# Altium schematic sheet power.SchDoc
size A1
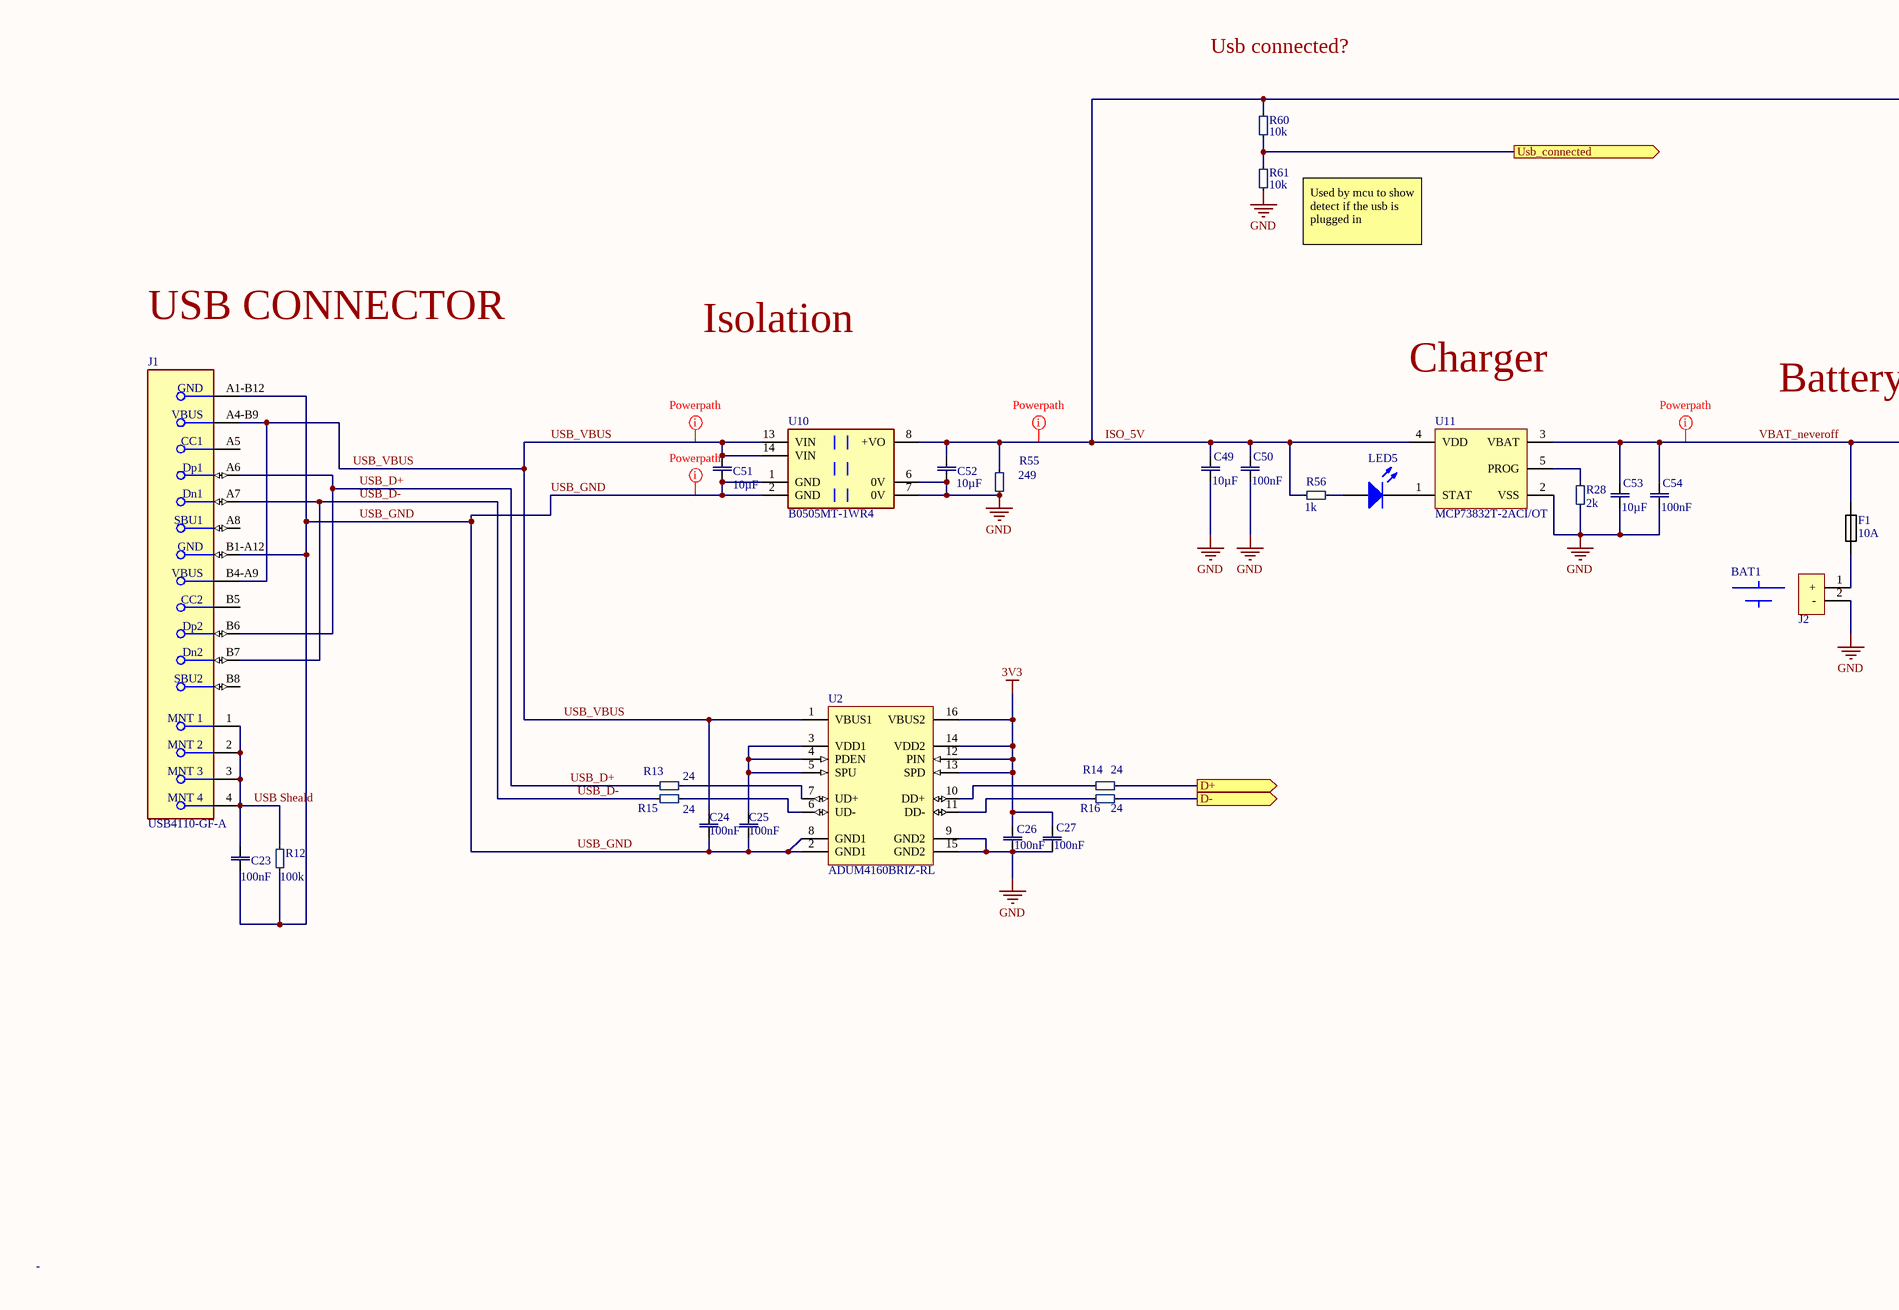
[diagram p0: power.SchDoc, left]
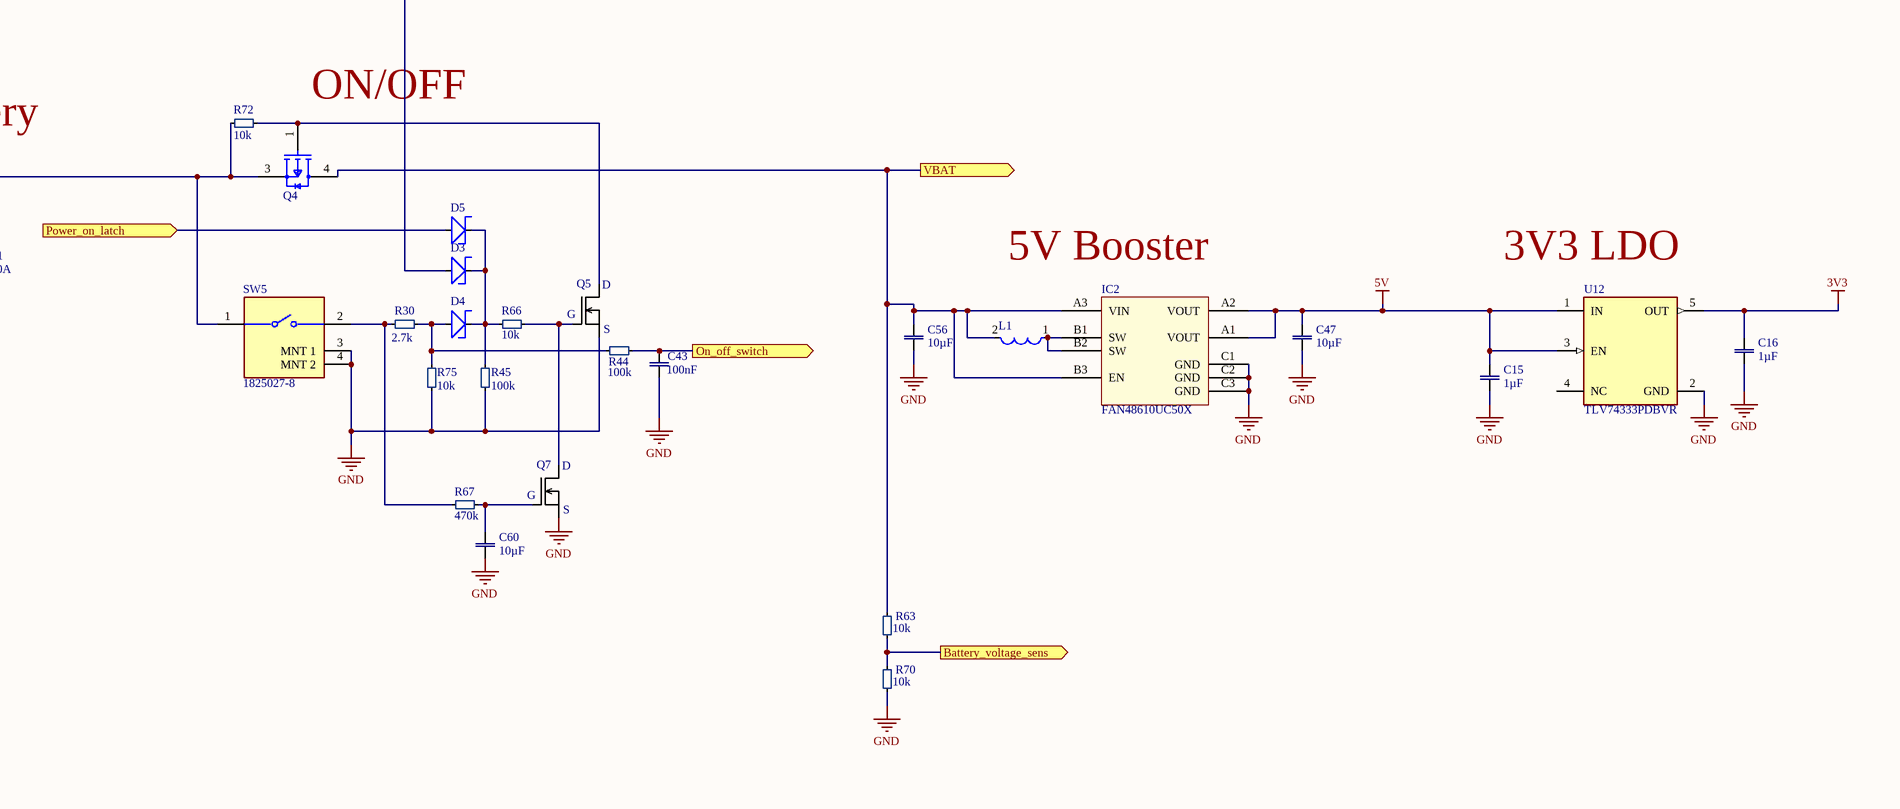
[diagram p1: power.SchDoc, right]

## Parts
BAT1  THN803465AJ  [THN803465AJ-Footprint-1]  (value not drawn)  (mechanical)
C15  Capacitance: 1µF  [CAP0805]  (hidden comment: CL21B105KBFNNNG)
C16  Capacitance: 1µF  [CAP0805]  (hidden comment: CL21B105KBFNNNG)
C23  Capacitance: 100nF  [cap0402]  (hidden comment: GRM155R71H104ME14D)
C24  Capacitance: 100nF  [cap0402]  (hidden comment: GRM155R71H104ME14D)
C25  Capacitance: 100nF  [cap0402]  (hidden comment: GRM155R71H104ME14D)
C26  Capacitance: 100nF  [cap0402]  (hidden comment: GRM155R71H104ME14D)
C27  Capacitance: 100nF  [cap0402]  (hidden comment: GRM155R71H104ME14D)
C43  Capacitance: 100nF  [cap0402]  (hidden comment: GRM155R71H104ME14D)
C47  Capacitance: 10µF  [Chip2PinSM127P600-8N]  (hidden comment: CL31A106MBHNNNE)
C49  Capacitance: 10µF  [Chip2PinSM127P600-8N]  (hidden comment: CL31A106MBHNNNE)
C50  Capacitance: 100nF  [cap0402]  (hidden comment: GRM155R71H104ME14D)
C51  Capacitance: 10µF  [Chip2PinSM127P600-8N]  (hidden comment: CL31A106MBHNNNE)
C52  Capacitance: 10µF  [Chip2PinSM127P600-8N]  (hidden comment: CL31A106MBHNNNE)
C53  Capacitance: 10µF  [Chip2PinSM127P600-8N]  (hidden comment: CL31A106MBHNNNE)
C54  Capacitance: 100nF  [cap0402]  (hidden comment: GRM155R71H104ME14D)
C56  Capacitance: 10µF  [Chip2PinSM127P600-8N]  (hidden comment: CL31A106MBHNNNE)
C60  Capacitance: 10µF  [Chip2PinSM127P600-8N]  (hidden comment: CL31A106MBHNNNE)
D3  BAS70_R1_00001  [SOT95P245X110-3N]  (value not drawn)
D4  BAS70_R1_00001  [SOT95P245X110-3N]  (value not drawn)
D5  BAS70_R1_00001  [SOT95P245X110-3N]  (value not drawn)
F1  current rating: 10A  [RESC3216X06N]  (hidden comment: 0685H9100-01)
IC2  FAN48610UC50X  [BGA9C40P3X3_211X211X58]
J1  USB4110-GF-A  [FP-USB4110-GF-A-MFG]
J2  1744048-2  [New footprint 1]  (value not drawn)
L1  LQM21PNR47MC0D  [FP-LQM21PN_C0-IPC_C]  (value not drawn)
LED5  150080BS75000  [0805_A]  (value not drawn)
Q4  RQ3C150BCTB  [RQ3C150BCTB-Footprint-1]  (value not drawn)
Q5  SSM3K7002CFU,LF  [SSM3K7002CFU,LF-Footprint-1]  (value not drawn)
Q7  SSM3K7002CFU,LF  [SSM3K7002CFU,LF-Footprint-1]  (value not drawn)
R12  Resistance: 100k  [SMD_0402(1005)_M]  (hidden comment: RC0402FR-07100KL)
R13  Resistance: 24  [RESC0402(1005)_N]  (hidden comment: RC0402FR-0724RL)
R14  Resistance: 24  [RESC0402(1005)_N]  (hidden comment: RC0402FR-0724RL)
R15  Resistance: 24  [RESC0402(1005)_N]  (hidden comment: RC0402FR-0724RL)
R16  Resistance: 24  [RESC0402(1005)_N]  (hidden comment: RC0402FR-0724RL)
R28  Resistance: 2k  [RESC1005X40X25NL05T10]  (hidden comment: RC0402FR-072KL)
R30  Resistance: 2.7k  [RESC1005X40X25NL05T10]  (hidden comment: RC0402FR-072K7L)
R44  Resistance: 100k  [SMD_0402(1005)_M]  (hidden comment: RC0402FR-07100KL)
R45  Resistance: 100k  [SMD_0402(1005)_M]  (hidden comment: RC0402FR-07100KL)
R55  Resistance: 249  [SMD_0402(1005)_M]  (hidden comment: RC0402FR-07249RL)
R56  Resistance: 1k  [SMD_0402(1005)_M]  (hidden comment: RC0402FR-071KL)
R60  Resistance: 10k  [SMD_0402(1005)_M]  (hidden comment: RC0402FR-0710KL)
R61  Resistance: 10k  [SMD_0402(1005)_M]  (hidden comment: RC0402FR-0710KL)
R63  Resistance: 10k  [SMD_0402(1005)_M]  (hidden comment: RC0402FR-0710KL)
R66  Resistance: 10k  [SMD_0402(1005)_M]  (hidden comment: RC0402FR-0710KL)
R67  Resistance: 470k  [SMD_0402(1005)_M]  (hidden comment: RC0402FR-07470KL)
R70  Resistance: 10k  [SMD_0402(1005)_M]  (hidden comment: RC0402FR-0710KL)
R72  Resistance: 10k  [SMD_0402(1005)_M]  (hidden comment: RC0402FR-0710KL)
R75  Resistance: 10k  [SMD_0402(1005)_M]  (hidden comment: RC0402FR-0710KL)
SW5  1825027-8  [FP-1825027-8-MFG]
U2  ADUM4160BRIZ-RL  [ADI-RI-16-1_N]
U10  B0505MT-1WR4  [FP-B0505MT-1WR4-MFG]
U11  MCP73832T-2ACI/OT  [SOT-23-OT5_M]
U12  TLV74333PDBVR  [FP-DBV0005A-IPC_A]

## Ports
Battery_voltage_sens (out), D+ (out), D- (out), On_off_switch (out), Power_on_latch (in), Usb_connected (out), VBAT (out)

## Nets
3V3: C16.2 C26.1 C27.1 U2.12(PIN) U2.13(SPD) U2.14(VDD2) U2.16(VBUS2) U12.5(OUT)
5V: C15.2 C47.2 IC2.A1(VOUT) IC2.A2(VOUT) U12.1(IN) U12.3(EN)
GND: C15.1 C16.1 C26.2 C27.2 C43.1 C47.1 C49.1 C50.1 C52.1 C53.1 C54.1 C56.1 C60.1 IC2.C1(GND) IC2.C2(GND) IC2.C3(GND) J2.2(-) Q5.2(D) Q7.2(D) R28.1 R45.2 R55.1 R61.1 R70.1 R75.1 SW5.3(MNT_1) SW5.4(MNT_2) U2.9(GND2) U2.15(GND2) U10.6(0V) U10.7(0V) U11.2(VSS) U12.2(GND)
Battery_voltage_sens: R63.1 R70.2 ; port Battery_voltage_sens
D+: R14.2 ; port D+
D-: R16.2 ; port D-
ISO_5V: C49.2 C50.2 C52.2 D3.1(A) R55.2 R56.2 R60.2 U10.8(+VO) U11.4(VDD)
On_off_switch: C43.2 R44.1 ; port On_off_switch
Power_on_latch: D5.1(A) ; port Power_on_latch
USB Sheald: C23.2 J1.1(MNT_1) J1.2(MNT_2) J1.3(MNT_3) J1.4(MNT_4) R12.2
Usb_connected: R60.1 R61.2 ; port Usb_connected
USB_D+: J1.A6(Dp1) J1.B6(Dp2) R13.1
USB_D-: J1.A7(Dn1) J1.B7(Dn2) R15.1
USB_GND: C23.1 C24.1 C25.2 C51.1 J1.A1-B12(GND) J1.B1-A12(GND) R12.1 U2.2(GND1) U2.8(GND1) U10.1(GND) U10.2(GND)
USB_VBUS: C24.2 C51.2 J1.A4-B9(VBUS) J1.B4-A9(VBUS) U2.1(VBUS1) U10.13(VIN) U10.14(VIN)
VBAT: C56.2 IC2.A3(VIN) IC2.B3(EN) L1.2 Q4.4(D) R63.2 ; port VBAT
VBAT_neveroff: C53.2 C54.2 F1.1 Q4.3(S) R72.1 SW5.1 U11.3(VBAT)
NetC25_1: C25.1 U2.3(VDD1) U2.4(PDEN) U2.5(SPU)
NetC60_2: C60.2 Q7.1(G) R67.2
NetD3_2: D3.2(K) D4.2(K) D5.2(K) R45.1 R66.2
NetD4_1: D4.1(A) R30.2 R44.2 R75.2
NetF1_2: F1.2 J2.1(+)
NetIC2_B1: IC2.B1(SW) IC2.B2(SW) L1.1
NetLED5_1: LED5.1(K) U11.1(STAT)
NetLED5_2: LED5.2(A) R56.1
NetQ4_1: Q4.1(G) Q5.3(S) R72.2
NetQ5_1: Q5.1(G) Q7.3(S) R66.1
NetR13_2: R13.2 U2.7(UD+)
NetR14_1: R14.1 U2.10(DD+)
NetR15_2: R15.2 U2.6(UD-)
NetR16_1: R16.1 U2.11(DD-)
NetR28_2: R28.2 U11.5(PROG)
NetR30_1: R30.1 R67.1 SW5.2

Not connected (* = marked no-connect by the designer): J1 A5(CC1) A8(SBU1) B5(CC2) B8(SBU2); U12 4(NC)

## Layout directives
net class Powerpath: ISO_5V, USB_GND, USB_VBUS, VBAT_neveroff

## Notes on the sheet
- Usb connected?
- Used by mcu to show detect if the usb is plugged in
- USB CONNECTOR
- Isolation
- Charger
- Battery
- ON/OFF
- (near IC2) 5V Booster
- (near U12) 3V3 LDO
- -

## Library data of the parts
BAT1 = CMP-ROOT-0005-4: 2500mAh 3.7V 1S 25C LiPO Battery JST plug for Drone RC Model Airplane Helicopter; Voltage: 3.7V; Mount: connector; RoHS: Yes; Capacity: 2500mAh; ComponentLink1URL: https://www.ebay.com/itm/264443381455?hash=item3d920dc6cf:g:E-IAAOSwjjJhZ4yo; ComponentLink1Description: EBAY; Type: li-po; Case/Package: THN803465AJ; LCSC Part#: -
C15 C16 = CMP-0001-00012-5: SAMSUNG ELECTRO-MECHANICS - CL21B105KBFNNNG - MLCC CAPACITORS; Voltage Rating: 50V; Dielectric: X7R; Material: Ceramic; Tolerance: 10%; RoHS: Yes; Termination: Wraparound; Case Code (Imperial): 0805; Min Operating Temperature: -55°C; Package Quantity: 3000; Packaging: Tape and Reel; Length: 2mm; Width: 0.049inch; Thickness: 0.053inch; Mount: Surface Mount; Contact Plating: Tin; Voltage: 50V; Max Operating Temperature: 125°C; Case Code (Metric): 2012; Depth: 1.25mm; Case/Package: 0805; Capacitor Type: Ceramic; LCSC Part#: -
C23-C27 C43 C50 C54 = CMP-0001-00001-10: 0402 0.1 uF 50 V ±20% Tolerance X7R SMT Monolithic Ceramic Chip Capacitor; Value: 100nF; Voltage Rating: 50V; Length: 0.039inch; Packaging: Cut Tape; Max Operating Temperature: 125°C; Min Operating Temperature: -55°C; Mount: Surface Mount; Case/Package: 0402; Tolerance: 20%; Width: 0.02inch; Capacitor Type: Ceramic; Thickness: 0.022inch; Pins: 2; RoHS: Yes; LCSC Part#: C182412
C47 C51 C56 C60 = CMP-0001-00015-4: CAP CER 10UF 50V X5R 1206; Tolerance: 20%; Capacitor Type: Ceramic; Packaging: Tape and Reel; Case Code (Metric): 3216; Voltage Rating: 50V; Voltage Rating (DC): 50V; RoHS: Yes; Case Code (Imperial): 1206; Thickness: 0.071inch; Min Operating Temperature: -55°C; Dielectric: X5R; Width: 0.063inch; Max Operating Temperature: 85°C; Case/Package: 1206; Mount: Surface Mount; Length: 0.126inch; LCSC Part#: C96600
C49 C52 C53 = CMP-0001-00015-4: CAP CER 10UF 50V X5R 1206; Capacitor Type: Ceramic; Tolerance: 20%; Thickness: 0.071inch; Mount: Surface Mount; Dielectric: X5R; Length: 0.126inch; Case/Package: 1206; Width: 0.063inch; Voltage Rating (DC): 50V; Max Operating Temperature: 85°C; Case Code (Imperial): 1206; Voltage Rating: 50V; Min Operating Temperature: -55°C; Packaging: Tape and Reel; Case Code (Metric): 3216; RoHS: Yes; LCSC Part#: C96600
D3-D5 = CMP-016-0000-3: Diode Schottky 70 V 200mA Surface Mount SOT-23; Max Repetitive Reverse Voltage (Vrrm): 70V; Peak Non-Repetitive Surge Current: 600mA; Max Reverse Current: 1uA; Element Configuration: Single; Case/Package: SOT-23; Mount: Surface Mount; RoHS: Yes; Radiation Hardening: No; Min Operating Temperature: -55°C; Forward Current: 200mA; Max Operating Temperature: 150°C; RoHS Compliant: Yes; Number of Pins: 3; LCSC Part#: -
F1 = CMP-ROOT-00047-2: Fuse Chip Fast Acting 10A 125V SMD Solder Pad 1206 3.2 X 1.58 X 0.65mm Ceramic T/R Automotive; Case/Package: 1206; RoHS: Yes; Mount: Surface Mount
IC2 = CMP-006-0009-3: 2.5 MHz, 1 A, Fixed-Output Synchronous TinyBoost® Regulator; Pin Count: 9; LCSC Part#: C890712
J1 = CMP-ROOT-00018-6: Conn Usb 2.0 Type-c R/a SMT; Number of Positions: 12; System: Connector; RoHS: Yes; Mount: TH; LCSC Part#: -
J2 = CMP-003-0011-2: Conn Power HDR 2 POS 5.08mm Solder RA Thru-Hole 2 Terminal 1 Port Bag; System: Connector; Number of Positions: 2; PCB Mount Retention: Without; Connector System: Wire-to-Board; PCB Mounting Orientation: Right Angle; PCB Thickness: 0.063mm; Connector Type: Tab; Voltage Rating (AC): 250V; PCB Mount Alignment: No (Without); Plating Thickness: 80um; Mating Alignment: Yes (With); Contact Current Rating: 8A; RoHS: Yes; Mount: Through Hole; Termination: Solder; Color: Natural; Housing Material: Nylon; Orientation: Right Angle; Contact Shape: Square; Radiation Hardening: No; Min Operating Temperature: -25°C; Number of Contacts: 2; Contact Plating: Tin; Housing Color: Natural; Series: Economy Power; Number of Rows: 1; Insulation Material: Nylon; RoHS Compliant: Yes; Width: 15mm; ELV: Compliant; Material: Nylon; Contact Material: Copper Alloy; Circuit Application: Power; Pitch: 5.08mm; Insulation Color: Natural; Contact Mating Length: 8.6mm; Contact Finish - Mating: TIN; Length: 7.68mm; Packaging: Bag; Lead Free: Not Applicable; Height: 0.3228inch; Strain Relief: No (Without); Sealable: No (Without); Max Operating Temperature: 105°C; Fastening Type: Friction; Contact Retention: No (Without); Flammability Rating: UL94 V-0; Mating Retention: Yes (With); Backwall/Post Interruptions: No (Without); Number of Power Positions: 2; Contact Type: Male Pin; Selectively Loaded: No (Without); Package Quantity: 1000; LCSC Part#: C590637
L1 = CMP-ROOT-00045-2: Inductor Power Chip Shielded Multi-Layer 0.47uH 20% 1MHz Ferrite 1.1A 0.15Ohm DCR 0805 T/R; Mount: Surface Mount; Case/Package: 0805; RoHS: Yes; LCSC Part#: C341670
LED5 = CMP-00002-2: SMD LED blue 3.5 V 0805, 150080BS75000, Würth Elektronik; Dominant Wavelength: 470nm; Luminous Intensity: 145mcd; Lens Style: Clear,Rectangular; Forward Current: 30mA; Test Current: 20mA; Forward Voltage: 3.2V; Viewing Angle: 140°; Length: 2mm; Width: 1.25mm; RoHS: Yes; Height: 0.7mm; Color: Blue; Packaging: Tape and Reel; REACH SVHC: Unknown; Max Operating Temperature: 85°C; Case Code (Imperial): 0805; Lead Free: Lead Free; Case Code (Metric): 2012; Case/Package: 0805; Min Operating Temperature: -40°C; Wavelength: 470nm; Package Quantity: 4000; Mount: Surface Mount; LCSC Part#: -
Q4 = CMP-ROOT-00044-5: Trans Mosfet P-ch 20V 15A 8-PIN Hsmt Ep T/r; Case/Package: 8-PowerVDFN; RoHS: Yes; Mount: Surface Mount; LCSC Part#: C266247
Q5 Q7 = CMP-ROOT-00035-4: Trans MOSFET N-CH Si 60V 0.17A 3-Pin USM T/R; Max Power Dissipation: 150mW; Continuous Drain Current (ID): 170mA; Input Capacitance: 17pF; Rds On Max: 3.0ohm; Case/Package: SMD/SMT; Drain to Source Voltage (Vdss): 60V; RoHS: Yes; Max Operating Temperature: 150°C; Mount: Surface Mount; Min Operating Temperature: -55°C; Packaging: Tape and Reel; LCSC Part#: C396059
R12 = CMP-0001-00006-6: Res General Purpose Thick Film 0402 100K Ohm 1% 1/16W ±100ppm/°C Molded SMD Paper T/R; Max Power Dissipation: 63mW; Voltage Rating: 50V; Value: 100k; Termination: SMD/SMT; Tolerance: 1%; Length: 0.039inch; REACH SVHC: No SVHC; Features: Moisture Resistant; Mount: SMD; Power Rating: 63mW; Depth: 0.5mm; Max Operating Temperature: 155°C; Width: 0.02inch; Height: 0.016inch; Case Code (Metric): 1005; Temperature Coefficient: 100ppm/°C; Military Standard: Not; Case/Package: 0402; Lead Free: Lead Free; Working Voltage: 50V; Package Quantity: 1; Number of Terminations: 2; Min Operating Temperature: -55°C; Composition: Thick Film; RoHS: Yes; Packaging: Tape and Reel; Case Code (Imperial): 0402; LCSC Part#: C60491
R13-R16 = CMP-0001-00017-5: Thick Film Resistors 24 OHM 1%; Voltage Rating: 50V; Temperature Coefficient: 100ppm/°C; Power Rating: 63mW; Width: 0.02inch; Working Voltage: 50V; Max Operating Temperature: 155°C; Min Operating Temperature: -55°C; Length: 1mm; Lead Free: Lead Free; Termination: SMD/SMT; REACH SVHC: No SVHC; Case Code (Imperial): 0402; Number of Terminations: 2; Features: Moisture Resistant; Voltage Rating (DC): 50V; Height: 0.016inch; Mount: SMD; Case/Package: 0402; Composition: Thick Film; Packaging: Tape and Reel; Military Standard: Not; Number of Pins: 2; RoHS: Yes; Max Power Dissipation: 63mW; Case Code (Metric): 1005; Depth: 0.5mm; Tolerance: 1%; LCSC Part#: C274890
R28 = CMP-001-0030-1: Res General Purpose Thick Film 0402 2K Ohm 1% 1/16W ±100ppm/°C Molded SMD Paper T/R; Voltage Rating: 50V; Power Rating: 63mW; Composition: Thick Film; Packaging: Tape and Reel; Depth: 0.5mm; Case Code (Metric): 1005; Min Operating Temperature: -55°C; Width: 0.02inch; Mount: SMD; Weight: 2.3E-05oz; Max Operating Temperature: 155°C; REACH SVHC: Unknown; Military Standard: Not; Value: 2k; Temperature Coefficient: 100ppm/°C; Length: 0.039inch; Case Code (Imperial): 0402; Tolerance: 1%; Case/Package: 0402; Termination: SMD/SMT; RoHS: Yes; Lead Free: Lead Free; Height: 0.016inch; LCSC Part#: C138017
R30 = CMP-001-0025-2: Res General Purpose Thick Film 0402 2.7k Ohm 1% 1/16W ±100ppm/°C Molded Paper T/R; Value: 2.2k; Voltage Rating: 50V; Power Rating: 62.5mW; Composition: Thick Film; Packaging: Tape and Reel; Depth: 0.5mm; Case Code (Metric): 1005; Min Operating Temperature: -55°C; Width: 0.02inch; Mount: SMD; Weight: 2.3E-05oz; Max Operating Temperature: 155°C; REACH SVHC: Unknown; Military Standard: Not; Temperature Coefficient: 100ppm/°C; Length: 0.039inch; Case Code (Imperial): 0402; Tolerance: 1%; Case/Package: 0402; Termination: SMD/SMT; RoHS: Yes; Lead Free: Lead Free; Height: 0.016inch; LCSC Part#: C138017
R44 R45 = CMP-0001-00006-6: Res General Purpose Thick Film 0402 100K Ohm 1% 1/16W ±100ppm/°C Molded SMD Paper T/R; Voltage Rating: 50V; Power Rating: 63mW; Case/Package: 0402; Tolerance: 1%; Composition: Thick Film; Case Code (Metric): 1005; Width: 0.02inch; Lead Free: Lead Free; Number of Terminations: 2; Mount: SMD; Termination: SMD/SMT; Military Standard: Not; REACH SVHC: No SVHC; Length: 0.039inch; Depth: 0.5mm; Working Voltage: 50V; Packaging: Tape and Reel; Value: 100k; Temperature Coefficient: 100ppm/°C; Case Code (Imperial): 0402; Max Operating Temperature: 155°C; Height: 0.016inch; RoHS: Yes; Min Operating Temperature: -55°C; Max Power Dissipation: 63mW; Features: Moisture Resistant; Package Quantity: 1; LCSC Part#: C60491
R55 = CMP-0001-00022-4: Res Thick Film 0402 249 Ohm 1% 1/16W ±100ppm/°C Molded SMD Paper T/R; Mount: SMD; Case/Package: 0402; RoHS: Yes; Tolerance: 1%; LCSC Part#: C185439
R56 = CMP-001-0000-9: Surface Mount Chip Resistor, Thick Film, RC Series, 1 kohm, 62.5 mW, 1%, 50 V, 0402 [1005 Metric]; Temperature Coefficient: 100ppm/°C; Value: 1k; Voltage Rating: 50V; Power Rating: 62.5mW; RoHS: Yes; Max Operating Temperature: 155°C; Width: 0.5mm; Case Code (Metric): 1005; Mount: SMD; Min Operating Temperature: -55°C; Lead Free: Lead Free; Military Standard: Not; Case Code (Imperial): 0402; Number of Pins: 2; Height: 0.32mm; Case/Package: 0402; Composition: Thick Film; Packaging: Tape and Reel; Length: 1mm; Tolerance: 1%; Depth: 0.5mm; Voltage Rating (DC): 50V; Termination: SMD/SMT; REACH SVHC: Unknown; LCSC Part#: C2935237
R60 R61 R63 R66 R70 R72 R75 = CMP-008-0005-11: Surface Mount Thick Film Resistor, Rc Series, 10 Kohm, 62.5 Mw, - 1%, 50 V, 0402 [1005 Metric]; Voltage Rating: 50V; Power Rating: 62.5mW; Value: 10k; Temperature Coefficient: 100ppm/°C; Case/Package: 0402; Lead Pitch: 0.2mm; Tolerance: 1%; Composition: Thick Film; Voltage Rating (DC): 50V; Case Code (Metric): 1005; Width: 0.5mm; Lead Free: Lead Free; Number of Terminations: 2; Number of Pins: 2; Mount: SMD; Termination: SMD/SMT; Military Standard: Not; REACH SVHC: No SVHC; Length: 1mm; Depth: 0.5mm; Working Voltage: 50V; Packaging: Tape and Reel; Case Code (Imperial): 0402; Max Operating Temperature: 155°C; Height: 0.32mm; RoHS: Yes; Min Operating Temperature: -55°C; LCSC Part#: C60490
R67 = CMP-001-0028-2: Res Thick Film 0402 470K Ohm 1% 1/16W +/-100ppm/ßC Molded SMD Paper T/R; Working Voltage: 50V; Power Rating: 62.5mW; Temperature Coefficient: 100ppm/°C; Max Power Dissipation: 63mW; Case/Package: 0402; Tolerance: 1%; Composition: Thick Film; Case Code (Metric): 1005; Width: 0.02inch; Lead Free: Lead Free; Number of Terminations: 2; Mount: SMD; Termination: SMD/SMT; Military Standard: Not; REACH SVHC: No SVHC; Length: 0.039inch; Depth: 0.5mm; Packaging: Tape and Reel; Case Code (Imperial): 0402; Max Operating Temperature: 155°C; Height: 0.016inch; RoHS: Yes; Min Operating Temperature: -55°C; Features: Moisture Resistant; Package Quantity: 1; LCSC Part#: C60491
SW5 = CMP-ROOT-00037-2: Switch Tactile OFF (ON) SPST Round Button PC Pins 0.05A 24VDC 1.57N Thru-Hole Loose Piece; Case/Package: Side Actuated; RoHS: Yes; Mount: Through Hole; LCSC Part#: C266196
U2 = CMP-00003-7: Digital Isolator CMOS 4-CH 12Mbps 16-Pin SOIC T/R; Turn-On Delay Time: 60ns; Channel Type: Bidirectional; Isolated Power: No; Min Supply Voltage: 3.1V; Max Supply Voltage: 5.5V; Nominal Supply Current: 6mA; Propagation Delay: 70ns; Number of Channels: 2; Data Rate: 12Mbps; Max Operating Temperature: 105°C; Min Operating Temperature: -40°C; Contact Plating: Tin,Matte; Package Quantity: 1000; Case/Package: SOIC; Packaging: Tape and Reel; Lead Free: Contains Lead; Number of Pins: 16; LCSC Part#: C660968
U10 = CMP-ROOT-00029-2: DC DC Converter 5V 1W; Case/Package: 14-SMD Module, 7 Leads; Mount: SMD; RoHS: Yes; LCSC Part#: C919693
U11 = CMP-006-0003-5: BATTERY CHARGER, 500mA, SOT23-5; Battery Type:Li-Ion, Li-Pol; Input Voltage:6V; Battery Charge Voltage:4.2V; Charge Current Max:500mA; Battery IC Case Style:SOT-23; No. of Pins:5; No. of Series Cells:1; Operating Temperature Max:85 C; Max Supply Voltage: 6V; Number of Cells: 1; Max Output Voltage: 4.5V; Max Power Dissipation: 1.54W; Min Supply Voltage: 3.75V; Min Output Voltage: 4.168V; Output Current: 10mA; Output Voltage: 4.2V; Width: 1.8mm; Case/Package: SOT-23; Height: 1.3mm; Radiation Hardening: No; Max Charge Current: 500mA; Min Operating Temperature: -40°C; Max Input Voltage: 6V; Contact Plating: Tin,Matte; Length: 3.1mm; Package Quantity: 3000; Termination: SMD/SMT; Number of Outputs: 1; Max Output Current: 500mA; Mount: Surface Mount; Number of Channels: 1; Max Operating Temperature: 85°C; REACH SVHC: No SVHC; Packaging: Tape and Reel; Number of Pins: 5; Power Dissipation: 1.54W; Lead Free: Lead Free; LCSC Part#: C38066
U12 = CMP-00004-2: 300mA Low-Dropout (LDO) Regulator 5-SOT-23 -40 to 125; Power Supply Rejection Ratio (PSRR): 28dB; Dropout Voltage: 270mV; Min Output Voltage: 3.3V; Output Configuration: Positive; Max Input Voltage: 5.5V; Output Type: Fixed; Number of Regulators: 1; Quiescent Current: 60uA; Max Operating Temperature: 125°C; Output Current: 300mA; Min Operating Temperature: -40°C; Case/Package: SOT-23-5; Packaging: Cut Tape; Mount: Surface Mount; LCSC Part#: C408972